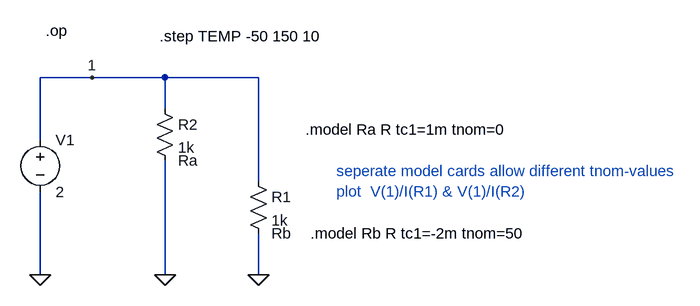
[diagram p0: schematic tc_of__res-2.asc]
tc_of__res-2.asc, the LTspice schematic file:
Version 4
SHEET 1 980 680
WIRE 96 0 16 0
WIRE 208 0 96 0
WIRE 352 0 208 0
WIRE 208 48 208 0
WIRE 16 96 16 0
WIRE 352 160 352 0
WIRE 16 304 16 176
WIRE 208 304 208 128
WIRE 352 304 352 240
FLAG 352 304 0
FLAG 16 304 0
FLAG 96 0 1
FLAG 208 304 0
SYMBOL res 336 144 R0
WINDOW 38 36 96 Left 0
SYMATTR InstName R1
SYMATTR Value 1k
SYMATTR SpiceModel Rb
SYMBOL res 192 32 R0
WINDOW 38 36 96 Left 0
SYMATTR InstName R2
SYMATTR Value 1k
SYMATTR SpiceModel Ra
SYMBOL voltage 16 80 R0
SYMATTR InstName V1
SYMATTR Value 2
TEXT 200 -64 Left 0 !.step TEMP -50 150 10
TEXT 24 -72 Left 0 !.op
TEXT 424 80 Left 0 !.model Ra R tc1=1m tnom=0
TEXT 432 240 Left 0 !.model Rb R tc1=-2m tnom=50
TEXT 472 144 Left 0 ;seperate model cards allow different tnom-values\nplot  V(1)/I(R1) & V(1)/I(R2)

The netlist it stands for:
* tc_of__res-2.asc
R1 1 0 Rb 1k
R2 1 0 Ra 1k
V1 1 0 2
.step TEMP -50 150 10
.op
.model Ra R tc1=1m tnom=0
.model Rb R tc1=-2m tnom=50
* seperate model cards allow different tnom-values
* plot  V(1)/I(R1) & V(1)/I(R2)
.backanno
.end